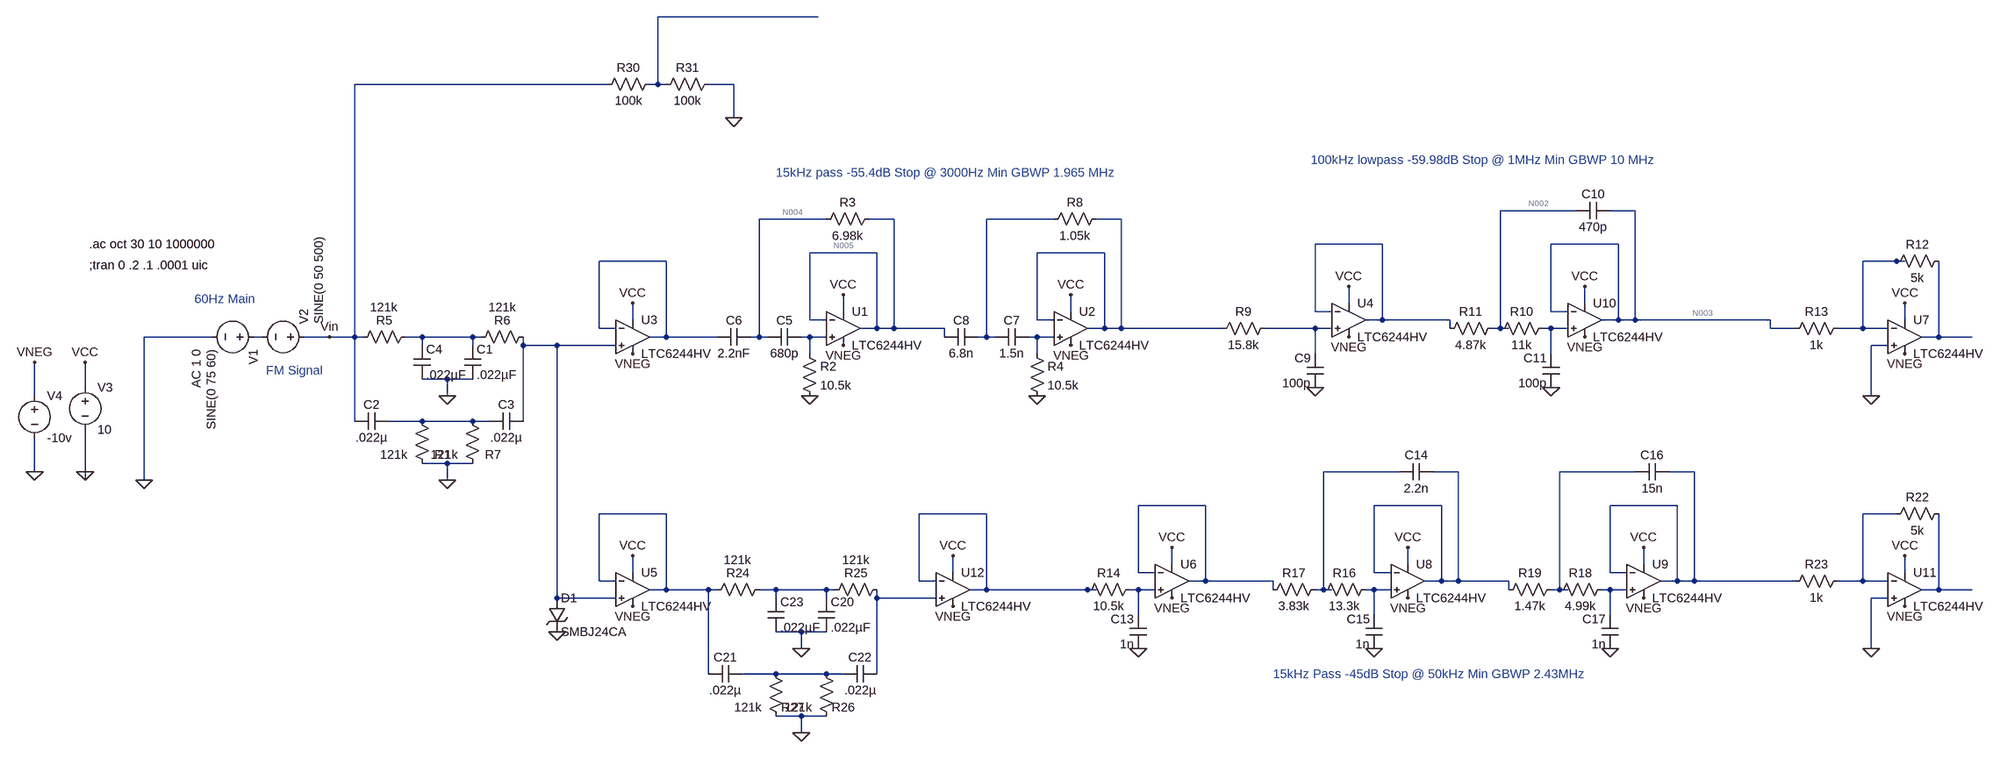
[diagram p0: schematic FilteringStageTesting.asc]
FilteringStageTesting.asc, the LTspice schematic file:
Version 4
SHEET 1 3480 1364
WIRE 736 -512 432 -512
WIRE 336 -384 -144 -384
WIRE 432 -384 432 -512
WIRE 432 -384 416 -384
WIRE 448 -384 432 -384
WIRE 576 -384 528 -384
WIRE 576 -320 576 -384
WIRE 2176 -144 2032 -144
WIRE 2288 -144 2240 -144
WIRE 752 -128 624 -128
WIRE 880 -128 832 -128
WIRE 1184 -128 1056 -128
WIRE 1312 -128 1264 -128
WIRE 1808 -80 1680 -80
WIRE 2256 -80 2128 -80
WIRE 848 -64 720 -64
WIRE 1280 -64 1152 -64
WIRE 448 -48 320 -48
WIRE 2784 -48 2720 -48
WIRE 2800 -48 2784 -48
WIRE 1744 32 1744 0
WIRE 2192 32 2192 0
WIRE 784 48 784 16
WIRE 1216 48 1216 16
WIRE 1680 48 1680 -80
WIRE 1712 48 1680 48
WIRE 2128 48 2128 -80
WIRE 2160 48 2128 48
WIRE 384 64 384 32
WIRE 720 64 720 -64
WIRE 752 64 720 64
WIRE 1152 64 1152 -64
WIRE 1184 64 1152 64
WIRE 1808 64 1808 -80
WIRE 1808 64 1776 64
WIRE 1936 64 1808 64
WIRE 2256 64 2256 -80
WIRE 2256 64 2224 64
WIRE 2288 64 2288 -144
WIRE 2288 64 2256 64
WIRE 2544 64 2288 64
WIRE 2800 64 2800 32
WIRE 320 80 320 -48
WIRE 352 80 320 80
WIRE 848 80 848 -64
WIRE 848 80 816 80
WIRE 880 80 880 -128
WIRE 880 80 848 80
WIRE 976 80 880 80
WIRE 1280 80 1280 -64
WIRE 1280 80 1248 80
WIRE 1312 80 1312 -128
WIRE 1312 80 1280 80
WIRE 1504 80 1312 80
WIRE 1680 80 1584 80
WIRE 1712 80 1680 80
WIRE 1936 80 1936 64
WIRE 2032 80 2032 -144
WIRE 2032 80 2016 80
WIRE 2048 80 2032 80
WIRE 2128 80 2112 80
WIRE 2160 80 2128 80
WIRE 2544 80 2544 64
WIRE 2592 80 2544 80
WIRE 2720 80 2720 -48
WIRE 2720 80 2672 80
WIRE 2768 80 2720 80
WIRE -416 96 -544 96
WIRE -320 96 -336 96
WIRE -192 96 -240 96
WIRE -144 96 -144 -384
WIRE -144 96 -192 96
WIRE -128 96 -144 96
WIRE -16 96 -48 96
WIRE 80 96 -16 96
WIRE 96 96 80 96
WIRE 448 96 448 -48
WIRE 448 96 416 96
WIRE 544 96 448 96
WIRE 624 96 624 -128
WIRE 624 96 608 96
WIRE 640 96 624 96
WIRE 720 96 704 96
WIRE 752 96 720 96
WIRE 976 96 976 80
WIRE 1056 96 1056 -128
WIRE 1056 96 1040 96
WIRE 1072 96 1056 96
WIRE 1152 96 1136 96
WIRE 1184 96 1152 96
WIRE 2864 96 2864 -48
WIRE 2864 96 2832 96
WIRE 2928 96 2864 96
WIRE -16 112 -16 96
WIRE 80 112 80 96
WIRE 176 112 176 96
WIRE 240 112 176 112
WIRE 352 112 240 112
WIRE 2768 112 2736 112
WIRE 720 128 720 96
WIRE 1152 128 1152 96
WIRE 1680 128 1680 80
WIRE 2128 128 2128 80
WIRE 32 176 -16 176
WIRE 80 176 32 176
WIRE -656 192 -656 144
WIRE -752 208 -752 144
WIRE 32 208 32 176
WIRE 2736 208 2736 112
WIRE -144 256 -144 96
WIRE -16 256 -80 256
WIRE 80 256 -16 256
WIRE 112 256 80 256
WIRE 176 256 176 112
WIRE 32 336 -16 336
WIRE 80 336 32 336
WIRE -752 352 -752 288
WIRE -656 352 -656 272
WIRE 1840 352 1696 352
WIRE 1952 352 1904 352
WIRE 2288 352 2144 352
WIRE 2400 352 2352 352
WIRE -656 368 -656 352
WIRE -544 368 -544 96
WIRE 32 368 32 336
WIRE 1472 416 1344 416
WIRE 1920 416 1792 416
WIRE 2368 416 2240 416
WIRE 448 432 320 432
WIRE 1056 432 928 432
WIRE 2784 432 2720 432
WIRE 1408 528 1408 496
WIRE 1856 528 1856 496
WIRE 2304 528 2304 496
WIRE 384 544 384 512
WIRE 992 544 992 512
WIRE 1344 544 1344 416
WIRE 1376 544 1344 544
WIRE 1792 544 1792 416
WIRE 1824 544 1792 544
WIRE 2240 544 2240 416
WIRE 2272 544 2240 544
WIRE 2800 544 2800 512
WIRE 320 560 320 432
WIRE 352 560 320 560
WIRE 928 560 928 432
WIRE 960 560 928 560
WIRE 1472 560 1472 416
WIRE 1472 560 1440 560
WIRE 1600 560 1472 560
WIRE 1920 560 1920 416
WIRE 1920 560 1888 560
WIRE 1952 560 1952 352
WIRE 1952 560 1920 560
WIRE 2048 560 1952 560
WIRE 2368 560 2368 416
WIRE 2368 560 2336 560
WIRE 2400 560 2400 352
WIRE 2400 560 2368 560
WIRE 2592 560 2400 560
WIRE 2720 560 2720 432
WIRE 2720 560 2672 560
WIRE 2768 560 2720 560
WIRE 448 576 448 432
WIRE 448 576 416 576
WIRE 528 576 448 576
WIRE 544 576 528 576
WIRE 656 576 624 576
WIRE 752 576 656 576
WIRE 768 576 752 576
WIRE 1056 576 1056 432
WIRE 1056 576 1024 576
WIRE 1248 576 1056 576
WIRE 1264 576 1248 576
WIRE 1344 576 1328 576
WIRE 1376 576 1344 576
WIRE 1600 576 1600 560
WIRE 1696 576 1696 352
WIRE 1696 576 1680 576
WIRE 1712 576 1696 576
WIRE 1792 576 1776 576
WIRE 1824 576 1792 576
WIRE 2048 576 2048 560
WIRE 2144 576 2144 352
WIRE 2144 576 2128 576
WIRE 2160 576 2144 576
WIRE 2240 576 2224 576
WIRE 2272 576 2240 576
WIRE 2864 576 2864 432
WIRE 2864 576 2832 576
WIRE 2928 576 2864 576
WIRE 240 592 240 112
WIRE 352 592 240 592
WIRE 656 592 656 576
WIRE 752 592 752 576
WIRE 848 592 848 576
WIRE 960 592 848 592
WIRE 2768 592 2736 592
WIRE 1344 624 1344 576
WIRE 1792 624 1792 576
WIRE 2240 624 2240 576
WIRE 704 656 656 656
WIRE 752 656 704 656
WIRE 704 688 704 656
WIRE 2736 688 2736 592
WIRE 528 736 528 576
WIRE 656 736 592 736
WIRE 752 736 656 736
WIRE 784 736 752 736
WIRE 848 736 848 592
WIRE 704 816 656 816
WIRE 752 816 704 816
WIRE 704 848 704 816
FLAG -544 368 0
FLAG -192 96 Vin
FLAG 32 208 0
FLAG 32 368 0
FLAG -656 352 0
FLAG -752 352 0
FLAG -656 144 VCC
FLAG -752 144 VNEG
FLAG 384 32 VCC
FLAG 384 128 VNEG
FLAG 384 512 VCC
FLAG 384 608 VNEG
FLAG 784 16 VCC
FLAG 784 112 VNEG
FLAG 720 208 0
FLAG 1216 16 VCC
FLAG 1216 112 VNEG
FLAG 1152 208 0
FLAG 2800 32 VCC
FLAG 2800 128 VNEG
FLAG 2736 208 0
FLAG 1408 496 VCC
FLAG 1408 592 VNEG
FLAG 1344 688 0
FLAG 1856 496 VCC
FLAG 1856 592 VNEG
FLAG 1792 688 0
FLAG 2304 496 VCC
FLAG 2304 592 VNEG
FLAG 2240 688 0
FLAG 2800 512 VCC
FLAG 2800 608 VNEG
FLAG 2736 688 0
FLAG 992 512 VCC
FLAG 992 608 VNEG
FLAG 240 656 0
FLAG 576 -320 0
FLAG 704 688 0
FLAG 704 848 0
FLAG 1744 0 VCC
FLAG 1744 96 VNEG
FLAG 1680 192 0
FLAG 2192 0 VCC
FLAG 2192 96 VNEG
FLAG 2128 192 0
SYMBOL voltage -320 96 R90
WINDOW 123 24 124 Left 2
WINDOW 39 0 0 Left 2
SYMATTR Value2 AC 1 0
SYMATTR InstName V1
SYMATTR Value SINE(0 75 60)
SYMBOL voltage -224 96 M270
WINDOW 39 0 0 Left 2
WINDOW 3 24 -12 Left 2
WINDOW 123 0 0 Left 2
SYMATTR Value SINE(0 50 500)
SYMATTR InstName V2
SYMBOL res -32 80 R90
WINDOW 0 0 56 VBottom 2
WINDOW 3 -56 57 VTop 2
SYMATTR InstName R5
SYMATTR Value 121k
SYMBOL res 192 80 R90
WINDOW 0 0 56 VBottom 2
WINDOW 3 -56 56 VTop 2
SYMATTR InstName R6
SYMATTR Value 121k
SYMBOL res 96 352 R180
WINDOW 0 -38 32 Left 2
WINDOW 3 43 32 Left 2
SYMATTR InstName R7
SYMATTR Value 121k
SYMBOL cap 64 112 R0
SYMATTR InstName C1
SYMATTR Value .022µF
SYMBOL cap -80 240 R90
WINDOW 0 0 32 VBottom 2
WINDOW 3 32 32 VTop 2
SYMATTR InstName C2
SYMATTR Value .022µ
SYMATTR SpiceLine Rser=3.9
SYMBOL cap 176 240 R90
WINDOW 0 0 32 VBottom 2
WINDOW 3 32 32 VTop 2
SYMATTR InstName C3
SYMATTR Value .022µ
SYMATTR SpiceLine Rser=3.9
SYMBOL voltage -656 176 R0
WINDOW 123 0 0 Left 2
WINDOW 39 0 0 Left 2
SYMATTR InstName V3
SYMATTR Value 10
SYMBOL voltage -752 192 R0
WINDOW 123 0 0 Left 2
WINDOW 39 0 0 Left 2
SYMATTR InstName V4
SYMATTR Value -10v
SYMBOL cap -32 112 R0
SYMATTR InstName C4
SYMATTR Value .022µF
SYMBOL res 0 352 R180
WINDOW 0 -38 32 Left 2
WINDOW 3 43 32 Left 2
SYMATTR InstName R1
SYMATTR Value 121k
SYMBOL Opamps\\LTC6244HV 384 96 R0
SYMATTR InstName U3
SYMBOL Opamps\\LTC6244HV 384 576 R0
SYMATTR InstName U5
SYMBOL Opamps\\LTC6244HV 784 80 R0
SYMATTR InstName U1
SYMBOL cap 704 80 R90
WINDOW 0 0 32 VBottom 2
WINDOW 3 32 32 VTop 2
SYMATTR InstName C5
SYMATTR Value 680p
SYMBOL cap 608 80 R90
WINDOW 0 0 32 VBottom 2
WINDOW 3 32 32 VTop 2
SYMATTR InstName C6
SYMATTR Value 2.2nF
SYMBOL res 704 112 R0
SYMATTR InstName R2
SYMATTR Value 10.5k
SYMBOL res 848 -144 R90
WINDOW 0 0 56 VBottom 2
WINDOW 3 32 56 VTop 2
SYMATTR InstName R3
SYMATTR Value 6.98k
SYMBOL Opamps\\LTC6244HV 1216 80 R0
SYMATTR InstName U2
SYMBOL cap 1136 80 R90
WINDOW 0 0 32 VBottom 2
WINDOW 3 32 32 VTop 2
SYMATTR InstName C7
SYMATTR Value 1.5n
SYMBOL cap 1040 80 R90
WINDOW 0 0 32 VBottom 2
WINDOW 3 32 32 VTop 2
SYMATTR InstName C8
SYMATTR Value 6.8n
SYMBOL res 1136 112 R0
SYMATTR InstName R4
SYMATTR Value 10.5k
SYMBOL res 1280 -144 R90
WINDOW 0 0 56 VBottom 2
WINDOW 3 32 56 VTop 2
SYMATTR InstName R8
SYMATTR Value 1.05k
SYMBOL Opamps\\LTC6244HV 2800 96 R0
SYMATTR InstName U7
SYMBOL res 2880 -64 R90
WINDOW 0 0 56 VBottom 2
WINDOW 3 32 56 VTop 2
SYMATTR InstName R12
SYMATTR Value 5k
SYMBOL res 2688 64 R90
WINDOW 0 0 56 VBottom 2
WINDOW 3 32 56 VTop 2
SYMATTR InstName R13
SYMATTR Value 1k
SYMBOL Opamps\\LTC6244HV 1408 560 R0
SYMATTR InstName U6
SYMBOL res 1344 560 R90
WINDOW 0 0 56 VBottom 2
WINDOW 3 32 56 VTop 2
SYMATTR InstName R14
SYMATTR Value 10.5k
SYMBOL cap 1360 688 R180
WINDOW 0 24 56 Left 2
WINDOW 3 24 8 Left 2
SYMATTR InstName C13
SYMATTR Value 1n
SYMBOL Opamps\\LTC6244HV 1856 560 R0
SYMATTR InstName U8
SYMBOL res 1792 560 R90
WINDOW 0 0 56 VBottom 2
WINDOW 3 32 56 VTop 2
SYMATTR InstName R16
SYMATTR Value 13.3k
SYMBOL res 1696 560 R90
WINDOW 0 0 56 VBottom 2
WINDOW 3 32 56 VTop 2
SYMATTR InstName R17
SYMATTR Value 3.83k
SYMBOL cap 1904 336 R90
WINDOW 0 0 32 VBottom 2
WINDOW 3 32 32 VTop 2
SYMATTR InstName C14
SYMATTR Value 2.2n
SYMBOL cap 1808 688 R180
WINDOW 0 24 56 Left 2
WINDOW 3 24 8 Left 2
SYMATTR InstName C15
SYMATTR Value 1n
SYMBOL Opamps\\LTC6244HV 2304 560 R0
SYMATTR InstName U9
SYMBOL res 2240 560 R90
WINDOW 0 0 56 VBottom 2
WINDOW 3 32 56 VTop 2
SYMATTR InstName R18
SYMATTR Value 4.99k
SYMBOL res 2144 560 R90
WINDOW 0 0 56 VBottom 2
WINDOW 3 32 56 VTop 2
SYMATTR InstName R19
SYMATTR Value 1.47k
SYMBOL cap 2352 336 R90
WINDOW 0 0 32 VBottom 2
WINDOW 3 32 32 VTop 2
SYMATTR InstName C16
SYMATTR Value 15n
SYMBOL cap 2256 688 R180
WINDOW 0 24 56 Left 2
WINDOW 3 24 8 Left 2
SYMATTR InstName C17
SYMATTR Value 1n
SYMBOL Opamps\\LTC6244HV 2800 576 R0
SYMATTR InstName U11
SYMBOL res 2880 416 R90
WINDOW 0 0 56 VBottom 2
WINDOW 3 32 56 VTop 2
SYMATTR InstName R22
SYMATTR Value 5k
SYMBOL res 2688 544 R90
WINDOW 0 0 56 VBottom 2
WINDOW 3 32 56 VTop 2
SYMATTR InstName R23
SYMATTR Value 1k
SYMBOL Opamps\\LTC6244HV 992 576 R0
SYMATTR InstName U12
SYMBOL TVSdiode 224 592 R0
WINDOW 0 24 0 Left 2
WINDOW 3 24 64 Left 2
SYMATTR InstName D1
SYMATTR Value SMBJ24CA
SYMATTR Description Diode
SYMATTR Type diode
SYMBOL res 432 -400 R90
WINDOW 0 0 56 VBottom 2
WINDOW 3 32 56 VTop 2
SYMATTR InstName R30
SYMATTR Value 100k
SYMBOL res 432 -368 R270
WINDOW 0 32 56 VTop 2
WINDOW 3 0 56 VBottom 2
SYMATTR InstName R31
SYMATTR Value 100k
SYMBOL res 640 560 R90
WINDOW 0 0 56 VBottom 2
WINDOW 3 -56 57 VTop 2
SYMATTR InstName R24
SYMATTR Value 121k
SYMBOL res 864 560 R90
WINDOW 0 0 56 VBottom 2
WINDOW 3 -56 56 VTop 2
SYMATTR InstName R25
SYMATTR Value 121k
SYMBOL res 768 832 R180
WINDOW 0 -38 32 Left 2
WINDOW 3 43 32 Left 2
SYMATTR InstName R26
SYMATTR Value 121k
SYMBOL cap 736 592 R0
SYMATTR InstName C20
SYMATTR Value .022µF
SYMBOL cap 592 720 R90
WINDOW 0 0 32 VBottom 2
WINDOW 3 32 32 VTop 2
SYMATTR InstName C21
SYMATTR Value .022µ
SYMATTR SpiceLine Rser=3.9
SYMBOL cap 848 720 R90
WINDOW 0 0 32 VBottom 2
WINDOW 3 32 32 VTop 2
SYMATTR InstName C22
SYMATTR Value .022µ
SYMATTR SpiceLine Rser=3.9
SYMBOL cap 640 592 R0
SYMATTR InstName C23
SYMATTR Value .022µF
SYMBOL res 672 832 R180
WINDOW 0 -38 32 Left 2
WINDOW 3 43 32 Left 2
SYMATTR InstName R27
SYMATTR Value 121k
SYMBOL Opamps\\LTC6244HV 1744 64 R0
SYMATTR InstName U4
SYMBOL res 1600 64 R90
WINDOW 0 0 56 VBottom 2
WINDOW 3 32 56 VTop 2
SYMATTR InstName R9
SYMATTR Value 15.8k
SYMBOL cap 1696 192 R180
WINDOW 0 24 56 Left 2
WINDOW 3 24 8 Left 2
SYMATTR InstName C9
SYMATTR Value 100p
SYMBOL Opamps\\LTC6244HV 2192 64 R0
SYMATTR InstName U10
SYMBOL res 2128 64 R90
WINDOW 0 0 56 VBottom 2
WINDOW 3 32 56 VTop 2
SYMATTR InstName R10
SYMATTR Value 11k
SYMBOL res 2032 64 R90
WINDOW 0 0 56 VBottom 2
WINDOW 3 32 56 VTop 2
SYMATTR InstName R11
SYMATTR Value 4.87k
SYMBOL cap 2240 -160 R90
WINDOW 0 0 32 VBottom 2
WINDOW 3 32 32 VTop 2
SYMATTR InstName C10
SYMATTR Value 470p
SYMBOL cap 2144 192 R180
WINDOW 0 24 56 Left 2
WINDOW 3 24 8 Left 2
SYMATTR InstName C11
SYMATTR Value 100p
TEXT -648 -40 Left 2 !;tran 0 .2 .1 .0001 uic
TEXT -312 160 Left 2 ;FM Signal
TEXT -448 24 Left 2 ;60Hz Main
TEXT -648 -80 Left 2 !.ac oct 30 10 1000000
TEXT 1600 736 Left 2 ;15kHz Pass -45dB Stop @ 50kHz Min GBWP 2.43MHz
TEXT 656 -216 Left 2 ;15kHz pass -55.4dB Stop @ 3000Hz Min GBWP 1.965 MHz
TEXT 1672 -240 Left 2 ;100kHz lowpass -59.98dB Stop @ 1MHz Min GBWP 10 MHz

The netlist it stands for:
* FilteringStageTesting.asc
V1 N013 0 SINE(0 75 60) AC 1 0
V2 Vin N013 SINE(0 50 500)
R5 N014 Vin 121k
R6 N018 N014 121k
R7 0 N019 121k
C1 N014 0 .022µF
C2 N019 Vin .022µ Rser=3.9
C3 N018 N019 .022µ Rser=3.9
V3 VCC 0 10
V4 VNEG 0 -10v
C4 N014 0 .022µF
R1 0 N019 121k
XU3 N018 N009 VCC VNEG N009 LTC6244HV  ; pins In+ In- V+ V- OUT
XU5 N018 N025 VCC VNEG N025 LTC6244HV  ; pins In+ In- V+ V- OUT
XU1 N015 N005 VCC VNEG N005 LTC6244HV  ; pins In+ In- V+ V- OUT
C5 N015 N004 680p
C6 N004 N009 2.2nF
R2 N015 0 10.5k
R3 N005 N004 6.98k
XU2 N016 N007 VCC VNEG N007 LTC6244HV  ; pins In+ In- V+ V- OUT
C7 N016 N006 1.5n
C8 N006 N005 6.8n
R4 N016 0 10.5k
R8 N007 N006 1.05k
XU7 0 N010 VCC VNEG N017 LTC6244HV  ; pins In+ In- V+ V- OUT
R12 N017 N010 5k
R13 N010 N003 1k
XU6 N029 N024 VCC VNEG N024 LTC6244HV  ; pins In+ In- V+ V- OUT
R14 N029 N026 10.5k
C13 0 N029 1n
XU8 N030 N021 VCC VNEG N021 LTC6244HV  ; pins In+ In- V+ V- OUT
R16 N030 N020 13.3k
R17 N020 N024 3.83k
C14 N021 N020 2.2n
C15 0 N030 1n
XU9 N031 N023 VCC VNEG N023 LTC6244HV  ; pins In+ In- V+ V- OUT
R18 N031 N022 4.99k
R19 N022 N021 1.47k
C16 N023 N022 15n
C17 0 N031 1n
XU11 0 N027 VCC VNEG N032 LTC6244HV  ; pins In+ In- V+ V- OUT
R22 N032 N027 5k
R23 N027 N023 1k
XU12 N033 N026 VCC VNEG N026 LTC6244HV  ; pins In+ In- V+ V- OUT
D1 N018 0 SMBJ24CA
R30 N001 Vin 100k
R31 N001 0 100k
R24 N028 N025 121k
R25 N033 N028 121k
R26 0 N034 121k
C20 N028 0 .022µF
C21 N034 N025 .022µ Rser=3.9
C22 N033 N034 .022µ Rser=3.9
C23 N028 0 .022µF
R27 0 N034 121k
XU4 N011 N008 VCC VNEG N008 LTC6244HV  ; pins In+ In- V+ V- OUT
R9 N011 N007 15.8k
C9 0 N011 100p
XU10 N012 N003 VCC VNEG N003 LTC6244HV  ; pins In+ In- V+ V- OUT
R10 N012 N002 11k
R11 N002 N008 4.87k
C10 N003 N002 470p
C11 0 N012 100p
.model D D
.lib standard.dio
;tran 0 .2 .1 .0001 uic
* FM Signal
* 60Hz Main
.ac oct 30 10 1000000
* 15kHz Pass -45dB Stop @ 50kHz Min GBWP 2.43MHz
* 15kHz pass -55.4dB Stop @ 3000Hz Min GBWP 1.965 MHz
* 100kHz lowpass -59.98dB Stop @ 1MHz Min GBWP 10 MHz
.lib LTC5.lib
.backanno
.end

* Results of the author's LTspice run, read from the files saved beside the schematic
* Operating Point, zero values left out:
*   V(vcc) = 10 V
*   V(vneg) = -10 V
*   I(V4) = 69.46 mA
*   I(V3) = -69.46 mA
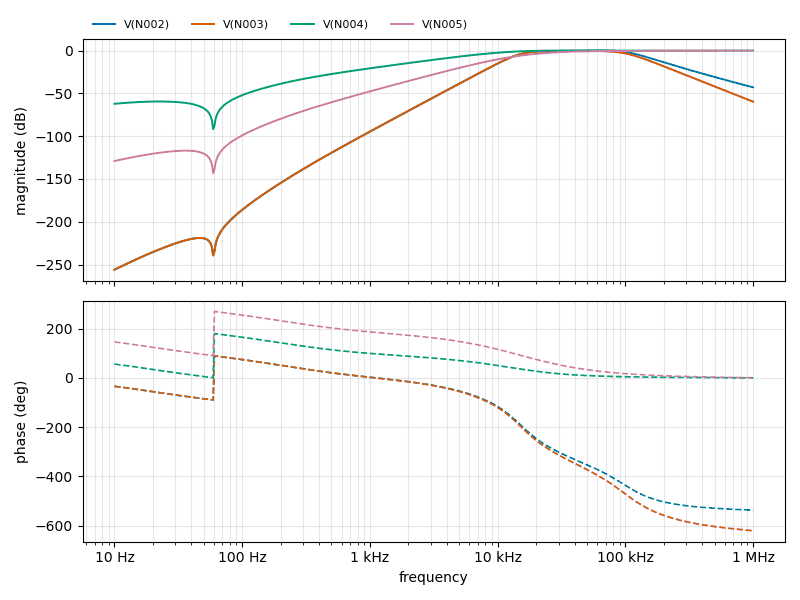
[diagram p1: AC Analysis of FilteringStageTesting.asc, plotted from the saved traces]
* AC Analysis, 1 run:
*   V(N002): -256.04 dB at 10 Hz, -42.80 dB at 1 MHz, peak 0.36 dB at 63.53 kHz, 3 dB below the peak at 16.5 kHz and 110.8 kHz
*   V(N003): -256.04 dB at 10 Hz, -59.58 dB at 1 MHz, peak -0.25 dB at 47.05 kHz, 3 dB below the peak at 15.81 kHz and 100.8 kHz
*   V(N004): -62.03 dB at 10 Hz, 0.08 dB at 1 MHz, peak 0.16 dB at 34.84 kHz, 3 dB below the peak at 9.1 kHz
*   V(N005): -128.99 dB at 10 Hz, 0.16 dB at 1 MHz, peak 0.16 dB at 1 MHz, 3 dB below the peak at 23.04 kHz